# EAGLE schematic ATtiny85_Handheld (EAGLE 9.6.2)
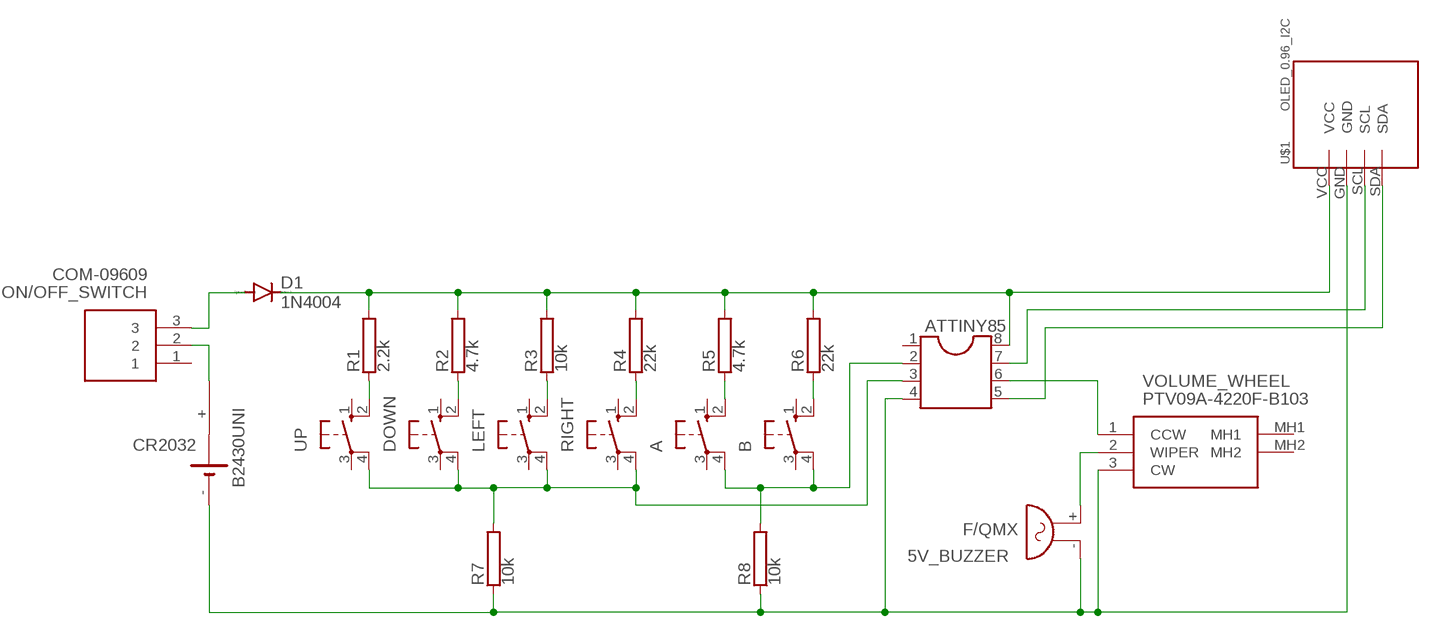
[diagram p0: schematic, sheet 1]

## Parts
5V_BUZZER  F/QMX  [F/QMX]
A  10-XX  [B3F-10XX]
ATTINY85  DIL8  [DIL08]
B  10-XX  [B3F-10XX]
CR2032  B2430UNI  [B2430UNI]
D1  1N4004  [DO41-10]
DOWN  10-XX  [B3F-10XX]
LEFT  10-XX  [B3F-10XX]
ON/OFF_SWITCH  COM-09609  [COM09609]
R1  2.2k  RAC01  [AC01]
R2  4.7k  RAC01  [AC01]
R3  10k  RAC01  [AC01]
R4  22k  RAC01  [AC01]
R5  4.7k  RAC01  [AC01]
R6  22k  RAC01  [AC01]
R7  10k  RAC01  [AC01]
R8  10k  RAC01  [AC01]
RIGHT  10-XX  [B3F-10XX]
U$1  OLED_0.96_I2C  [OLED_0.96_I2C]
UP  10-XX  [B3F-10XX]
VOLUME_WHEEL  PTV09A-4220F-B103  [PTV09A4220FB103]

## Nets
N$1: CR2032.+ ON/OFF_SWITCH.2
N$2: ATTINY85.8 D1.C R1.2 R2.2 R3.2 R4.2 R5.2 R6.2 U$1.VCC
N$3: R4.1 RIGHT.2(S1)
N$4: LEFT.2(S1) R3.1
N$5: DOWN.2(S1) R2.1
N$6: R1.1 UP.2(S1)
N$7: ATTINY85.3 DOWN.4(P1) LEFT.4(P1) R7.2 RIGHT.4(P1) UP.4(P1)
N$8: A.2(S1) R5.1
N$9: B.2(S1) R6.1
N$10: A.4(P1) ATTINY85.2 B.4(P1) R8.2
N$11: 5V_BUZZER.- ATTINY85.4 CR2032.- R7.1 R8.1 U$1.GND VOLUME_WHEEL.3(CW)
N$12: ATTINY85.5 U$1.SDA
N$13: ATTINY85.7 U$1.SCL
N$14: 5V_BUZZER.+ VOLUME_WHEEL.2(WIPER)
N$15: ATTINY85.6 VOLUME_WHEEL.1(CCW)
N$16: D1.A ON/OFF_SWITCH.3
Unconnected: A.1(S) A.3(P) ATTINY85.1 B.1(S) B.3(P) CR2032.+@1(+) CR2032.+@2(+) CR2032.+@3(+) CR2032.+@4(+) CR2032.-@1(-) DOWN.1(S) DOWN.3(P) LEFT.1(S) LEFT.3(P) ON/OFF_SWITCH.1 RIGHT.1(S) RIGHT.3(P) UP.1(S) UP.3(P) VOLUME_WHEEL.MH1 VOLUME_WHEEL.MH2

## Library data of the parts
5V_BUZZER = buzzer:F/QMX: BUZZER Source: Buerklin; OC_FARNELL: unknown; OC_NEWARK: unknown
A B DOWN LEFT RIGHT UP = switch-omron:10-XX: OMRON SWITCH; MPN: B3F-1000; OC_FARNELL: 176432; OC_NEWARK: 36M3542
ATTINY85 = ic-package:DIL8: Dual In Line / Socket
CR2032 = battery:B2430UNI: LI BATTERY
D1 = diode:1N4004: DIODE general purpose rectifier, 1 A
ON/OFF_SWITCH = COM-09609:COM-09609: SPDT Slide Switch Source: Datasheet <https://www.arrow.com/en/products/com-09609/sparkfun-electronics>; ARROW_PART_NUMBER: COM-09609; ARROW_PRICE-STOCK: https://www.arrow.com/en/products/com-09609/sparkfun-electronics; DESCRIPTION: SPDT Slide Switch; HEIGHT: 3.5mm; MANUFACTURER_NAME: SparkFun; MANUFACTURER_PART_NUMBER: COM-09609; MOUSER_PART_NUMBER: 474-COM-09609; MOUSER_PRICE-STOCK: https://www.mouser.com/Search/Refine.aspx?Keyword=474-COM-09609
R1-R8 = resistor-power:R: Power Resitor; OC_FARNELL: unknown; OC_NEWARK: unknown
U$1 = tft_1_8_1_44_oled_0_96:OLED_0.96_I2C
VOLUME_WHEEL = VolumeWheel:PTV09A-4220F-B103: Potentiometers 10K 20% 9MM CARBON POT Source: Datasheet <https://www.bourns.com/docs/product-datasheets/PTV09.pdf>; ARROW_PART_NUMBER: PTV09A-4220F-B103; ARROW_PRICE-STOCK: https://www.arrow.com/en/products/ptv09a-4220f-b103/bourns?region=nac; DESCRIPTION: Potentiometers 10K 20% 9MM CARBON POT; HEIGHT: 20.5mm; MANUFACTURER_NAME: Bourns; MANUFACTURER_PART_NUMBER: PTV09A-4220F-B103; MOUSER_PART_NUMBER: 652-PTV09A-4220FB103; MOUSER_PRICE-STOCK: https://www.mouser.co.uk/ProductDetail/Bourns/PTV09A-4220F-B103?qs=Qzws7J6gxqx7kQLhGnRMrg%3D%3D